# Altium schematic sheet CP2102_USB_To_UART.SchDoc
size B; SheetNumber: 1; SheetTotal: 1
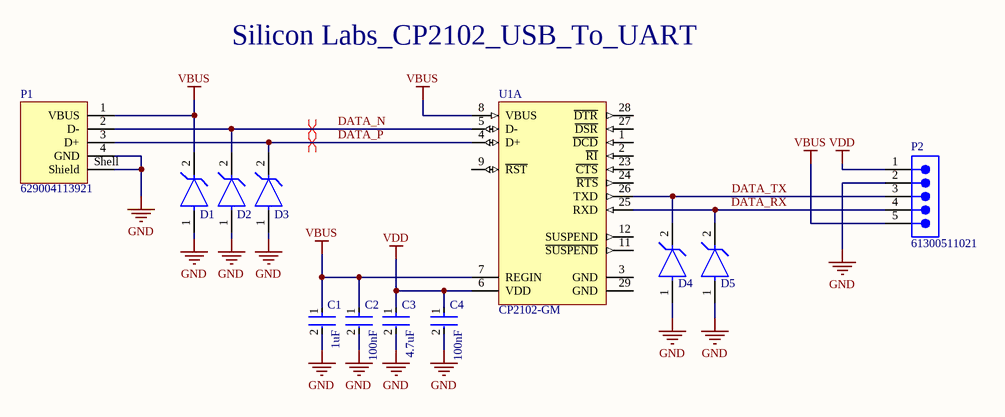
[diagram p0: CP2102_USB_To_UART.SchDoc]

## Parts
C1  Capacitance: 1uF  [FP-CC0402-MFG]  (hidden comment: CC0402KRX5R6BB105)
C2  Capacitance: 100nF  [FP-C1005-050-0_05-MFG]  (hidden comment: C1005X7R1C104K050BC)
C3  Capacitance: 4.7uF  [FP-GRM155-0_15-MFG]  (hidden comment: GRM155R61A475MEAAD)
C4  Capacitance: 100nF  [FP-C1005-050-0_05-MFG]  (hidden comment: C1005X7R1C104K050BC)
D1  UCLAMP3601P.TNT  [FP-SLP1006P2-MFG]  (value not drawn)
D2  UCLAMP3601P.TNT  [FP-SLP1006P2-MFG]  (value not drawn)
D3  UCLAMP3601P.TNT  [FP-SLP1006P2-MFG]  (value not drawn)
D4  UCLAMP3601P.TNT  [FP-SLP1006P2-MFG]  (value not drawn)
D5  UCLAMP3601P.TNT  [FP-SLP1006P2-MFG]  (value not drawn)
P1  629004113921  [629004113921]
P2  61300511021  [61300511021]
U1  CP2102-GM  [SLAB-QFN-28-3125x3125TP_N]  (part A of 2)

## Nets
GND: C1.2 C2.2 C3.2 C4.2 D1.1(A) D2.1(A) D3.1(A) D4.1(A) D5.1(A) P1.4(GND) P1.Shell(Shield) P2.2
VBUS: C1.1 C2.1 D1.2(C) P1.1(VBUS) P2.5 U1.7(REGIN) U1.8(VBUS)
VDD: C3.1 C4.1 P2.1 U1.6(VDD)
DATA_N: D2.2(C) P1.2(D-) U1.5(D-)
DATA_P: D3.2(C) P1.3(D+) U1.4(D+)
DATA_RX: D5.2(C) P2.4 U1.25(RXD)
DATA_TX: D4.2(C) P2.3 U1.26(TXD)

Not connected (* = marked no-connect by the designer): U1 1(~{DCD}) 2(~{RI}) 3(GND) 9(~{RST}) 11(~{SUSPEND}) 12(SUSPEND) 23(~{CTS}) 24(~{RTS}) 27(~{DSR}) 28(~{DTR}) 29(GND)

## Layout directives
differential pair: DATA_N, DATA_P

## Notes on the sheet
- Silicon Labs_CP2102_USB_To_UART

## Library data of the parts
C1 = CMP-03422-000489-1: CAP CER 1UF 10V X5R 0402; Manufacturer: YAGEO; Temperature Coefficient: 30ppm/°C; Tolerance: 0.1; Automotive Grade: NA; Material: Ceramic; Device Class L1: Passive Components; Ipc Land Pattern Name: CAPC10050X50; Height: 0.55mm; Voltage Rating: 10 V; Digikey Description: CAP CER 1UF 10V X5R 0402; RoHS: TRUE; Temperature: -55°C to +125°C; Octopart: https://octopart.com/cc0402krx5r6bb105-yageo-42244620; Mouser Description: Multilayer Ceramic Capacitors MLCC - SMD/SMT 1uF 10V X5R 10%; Manufacturer Part Number: CC0402KRX5R6BB105; Temperature Characteristic: X5R; Category: Cap; Automotive: No; Temperature Range Low: -55°C; Value: 1uF; ComponentLink2Description: Datasheet; Temperature Range High: +125°C; Package: CC0402; Footprint Url: http://www.yageo.com/exep/pages/download/literatures/UPY-C_GEN_24.pdf; ComponentLink2URL: http://www.yageo.com/documents/recent/UPY-GP_NP0_16V-to-50V_16.pdf; Lead Free: Yes; Device Class L3: Ceramic Capacitors; Device Class L2: Capacitors
C2 C4 = CMP-08246-004182-1: Multilayer Ceramic Capacitors 100nF ±10% 16V X7R SMD 0402; Voltage: 16V; Depth: 0.5mm; Dielectric Material: Ceramic; Lead Free: Lead Free; Number of Pins: 2; Mount: Surface Mount; Radiation Hardening: No; Case/Package: 0402; Voltage Rating: 16V; Dielectric: X7R; Min Operating Temperature: -55°C; RoHS Compliant: Yes; Tolerance: 10%; Voltage Rating (DC): 16V; Max Operating Temperature: 125°C; Case Code (Metric): 1005; Height: 0.5mm; Thickness: 0.022inch; Package Quantity: 1; Packaging: Tape and Reel; Termination: SMD/SMT; Construction: Flat; Resistor Type: Ceramic; Length: 1mm; Case Code (Imperial): 0402; Width: 0.02inch; Series: C; Weight: 2.3E-05oz
C3 = CMP-06035-003573-1: Chip Multilayer Ceramic Capacitors for General Purpose, 0402, 4.7uF, X5R, 15%, 20%, 10V; Case/Package: 0402; Voltage Rating: 10V; Min Operating Temperature: -55°C; Mount: Surface Mount; Packaging: Tape and Reel; Max Operating Temperature: 85°C; Case Code (Metric): 1005; Case Code (Imperial): 0402; Tolerance: 20%
D1-D5 = CMP-56445-000005-1: TVS DIODE 33VWM 60VC SLP1006P2; Direction: Unidirectional; Min Breakdown Voltage: 36V; Leakage Current: 1uA; Peak Pulse Power: 125W; Power Line Protection: No; Number of Unidirectional Channels: 1; Clamping Voltage: 60V; Peak Pulse Current: 2A; Power Dissipation: 170W; Diode Type: ZENER; Element Configuration: Single; Reverse Standoff Voltage: 33V; Max Breakdown Voltage: 45V; Max Operating Temperature: 125°C; Resistor Type: Zener; Series: Automotive, AEC-Q100, uClamp®; Min Operating Temperature: -40°C; Case Code (Imperial): 0402; Number of Pins: 2; Lead Free: Lead Free; Case/Package: SMD/SMT; RoHS Compliant: Yes; Packaging: Tape and Reel; Clamping Voltage-Max: 60V; Depth: 0.6mm; Case Code (Metric): 1006; Length: 1mm; Radiation Hardening: No; Mount: Surface Mount; Working Voltage: 33V
P1 = CMP-1502-03242-2: NexarPartId: 19991169; USB Standard: USB 2.0; Gender: Male; Connector Type: USB; Contact Resistance: 20mΩ; Current Rating: 1.5A; Number of Contacts: 4; Insulation Resistance: 1GΩ; Operating Supply Voltage: 30V; Termination: SMD/SMT; Lead Free: Lead Free; Max Operating Temperature: 105°C; Mount: Horizontal, Surface Mount; Features: Shielded; Orientation: Horizontal; Length: 18.8mm; REACH SVHC: Unknown; Min Operating Temperature: -40°C; Contact Plating: Gold; Number of Pins: 4; RoHS: Compliant
P2 = CMP-1502-01067-3: NexarPartId: 32855525; Contact Resistance: 20mΩ; Current Rating: 3A; Number of Contacts: 5; Pitch: 2.54mm; Operating Supply Voltage: 250V; Connector Type: Male Pin; Gender: Male; Number of Rows: 1; Packaging: Bulk; REACH SVHC: Unknown; Mount: Through Hole; RoHS: Compliant; Termination: Solder; Contact Mating Length: 5.9944mm; Color: Black; Number of Positions: 5; Contact Plating: Gold; Number of Pins: 5; Contact Material: Copper; Lead Pitch: 2.54mm
U1 = CMP-0511-00012-1: Single-Chip USB to UART Bridge, 1024 Bytes EEPROM, -40 to 85 degC, 28-pin QFN, Tube; Manufacturer: Silicon Labs; Internal Oscillator: TRUE; Sub-Family: USB Bridges; ComponentLink3Description: Package Specification; PackageDescription: 28-Pin Quad-Flat No-Leads Package, Body 5 x 5 mm, Pitch 0.5 mm; PartNumber: CP2102-GM; EEPROM: 1024 Bytes; Mounting Technology: Surface Mount; ComponentLink2URL: http://www.silabs.com/Support%20Documents/TechnicalDocs/CP2102-9.pdf; DatasheetVersion: Rev. 1.5; ComponentLink1URL: http://www.silabs.com/; ComponentLink2Description: Datasheet; Code_JEDEC: MO-220; PackageReference: QFN-28; Code_IPC: J-STD-020C; ComponentLink3URL: http://www.silabs.com/Support%20Documents/TechnicalDocs/C8051T61x.pdf; ComponentLink1Description: Manufacturer URL